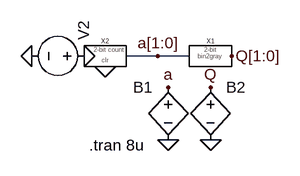
[diagram p0: schematic test-bin2gray_2bit.asc]
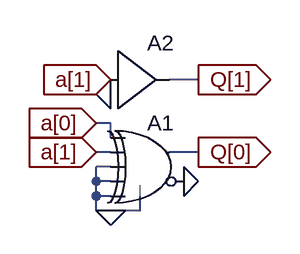
[diagram p1: sub-circuit bin2gray_2bit.asc]
test-bin2gray_2bit.asc, the LTspice schematic file:
Version 4
SHEET 1 880 680
WIRE 144 112 96 112
WIRE 192 112 144 112
FLAG 144 112 a[1:0]
FLAG 256 112 Q[1:0]
FLAG -48 112 0
FLAG 160 240 0
FLAG 224 240 0
FLAG 160 160 a
FLAG 224 160 Q
FLAG 64 128 0
SYMBOL bin2gray_2bit 224 112 R0
SYMATTR InstName X1
SYMBOL voltage 48 112 M270
WINDOW 3 24 96 Invisible 2
WINDOW 123 0 0 Left 0
WINDOW 39 0 0 Left 0
SYMATTR Value PULSE(0 1 1u 0 0 1u 2u)
SYMATTR InstName V2
SYMBOL bv 160 144 M0
WINDOW 3 24 96 Invisible 2
SYMATTR Value V=V(a[0])+2*V(a[1])
SYMATTR InstName B1
SYMBOL bv 224 144 R0
WINDOW 3 24 96 Invisible 2
SYMATTR Value V=V(Q[0])+2*V(Q[1])
SYMATTR InstName B2
SYMBOL up_2bitcounter 64 112 R0
SYMATTR InstName X2
TEXT 40 248 Left 2 !.tran 8u

bin2gray_2bit.asc, the sub-circuit schematic file:
Version 4
SHEET 1 880 680
WIRE 240 80 208 80
WIRE 144 128 128 128
WIRE 144 144 144 128
WIRE 144 160 128 160
WIRE 240 160 208 160
WIRE 144 176 128 176
WIRE 128 192 128 176
WIRE 144 192 128 192
WIRE 128 208 128 192
WIRE 144 208 128 208
WIRE 128 224 128 208
WIRE 144 224 128 224
WIRE 176 224 176 208
WIRE 176 224 144 224
FLAG 144 224 0
FLAG 144 96 0
FLAG 224 192 0
FLAG 144 80 a[1]
IOPIN 144 80 In
FLAG 128 160 a[1]
IOPIN 128 160 In
FLAG 128 128 a[0]
IOPIN 128 128 In
FLAG 240 160 Q[0]
IOPIN 240 160 Out
FLAG 240 80 Q[1]
IOPIN 240 80 Out
SYMBOL Digital\\xor 192 112 R0
SYMATTR InstName A1
SYMBOL Digital\\buf1 144 16 R0
SYMATTR InstName A2

The netlist it stands for:
* test-bin2gray_2bit.asc
XX1 a[1] a[0] Q[1] Q[0] bin2gray_2bit
V2 P001 0 PULSE(0 1 1u 0 0 1u 2u)
B1 a 0 V=V(a[0])+2*V(a[1])
B2 Q 0 V=V(Q[0])+2*V(Q[1])
XX2 P001 0 a[1] a[0] up_2bitcounter  ; pins clk clr Q[1:0]

* block symbol definitions
.subckt bin2gray_2bit a[1] a[0] Q[1] Q[0]
A1 a[0] a[1] 0 0 0 0 Q[0] 0 XOR
A2 a[1] 0 0 0 0 0 Q[1] 0 BUF
.ends bin2gray_2bit

.tran 8u
.backanno
.end